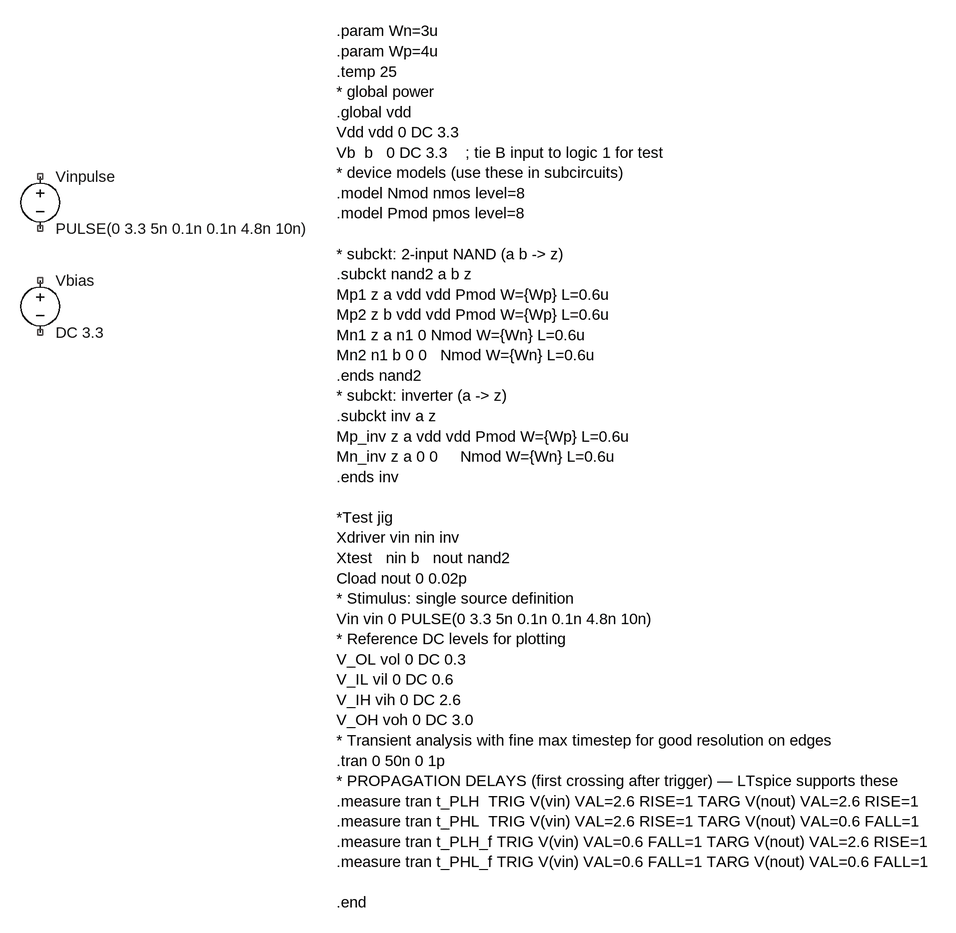
[diagram p0: schematic E.asc]
E.asc, the LTspice schematic file:
Version 4.1
SHEET 1 1580 1692
SYMBOL voltage 96 -144 R0
WINDOW 123 0 0 Left 0
WINDOW 39 0 0 Left 0
SYMATTR InstName Vinpulse
SYMATTR Value PULSE(0 3.3 5n 0.1n 0.1n 4.8n 10n)
SYMBOL voltage 96 16 R0
WINDOW 123 0 0 Left 0
WINDOW 39 0 0 Left 0
SYMATTR InstName Vbias
SYMATTR Value DC 3.3
TEXT 552 -352 Left 2 !.param Wn=3u\n.param Wp=4u\n.temp 25\n* global power\n.global vdd\nVdd vdd 0 DC 3.3\nVb  b   0 DC 3.3    ; tie B input to logic 1 for test\n* device models (use these in subcircuits)\n.model Nmod nmos level=8\n.model Pmod pmos level=8\n \n* subckt: 2-input NAND (a b -> z)\n.subckt nand2 a b z\nMp1 z a vdd vdd Pmod W={Wp} L=0.6u\nMp2 z b vdd vdd Pmod W={Wp} L=0.6u\nMn1 z a n1 0 Nmod W={Wn} L=0.6u\nMn2 n1 b 0 0   Nmod W={Wn} L=0.6u\n.ends nand2\n* subckt: inverter (a -> z)\n.subckt inv a z\nMp_inv z a vdd vdd Pmod W={Wp} L=0.6u\nMn_inv z a 0 0     Nmod W={Wn} L=0.6u\n.ends inv\n \n*Test jig \nXdriver vin nin inv\nXtest   nin b   nout nand2\nCload nout 0 0.02p\n* Stimulus: single source definition \nVin vin 0 PULSE(0 3.3 5n 0.1n 0.1n 4.8n 10n)\n* Reference DC levels for plotting \nV_OL vol 0 DC 0.3\nV_IL vil 0 DC 0.6\nV_IH vih 0 DC 2.6\nV_OH voh 0 DC 3.0\n* Transient analysis with fine max timestep for good resolution on edges\n.tran 0 50n 0 1p\n* PROPAGATION DELAYS (first crossing after trigger) — LTspice supports these\n.measure tran t_PLH  TRIG V(vin) VAL=2.6 RISE=1 TARG V(nout) VAL=2.6 RISE=1\n.measure tran t_PHL  TRIG V(vin) VAL=2.6 RISE=1 TARG V(nout) VAL=0.6 FALL=1\n.measure tran t_PLH_f TRIG V(vin) VAL=0.6 FALL=1 TARG V(nout) VAL=2.6 RISE=1\n.measure tran t_PHL_f TRIG V(vin) VAL=0.6 FALL=1 TARG V(nout) VAL=0.6 FALL=1\n \n.end

The netlist it stands for:
* E.asc
Vinpulse NC_01 NC_02 PULSE(0 3.3 5n 0.1n 0.1n 4.8n 10n)
Vbias NC_03 NC_04 DC 3.3
.param Wn=3u
.param Wp=4u
.temp 25
* global power
.global vdd
Vdd vdd 0 DC 3.3
Vb  b   0 DC 3.3    ; tie B input to logic 1 for test
* device models (use these in subcircuits)
.model Nmod nmos level=8
.model Pmod pmos level=8
* subckt: 2-input NAND (a b -> z)
.subckt nand2 a b z
Mp1 z a vdd vdd Pmod W={Wp} L=0.6u
Mp2 z b vdd vdd Pmod W={Wp} L=0.6u
Mn1 z a n1 0 Nmod W={Wn} L=0.6u
Mn2 n1 b 0 0   Nmod W={Wn} L=0.6u
.ends nand2
* subckt: inverter (a -> z)
.subckt inv a z
Mp_inv z a vdd vdd Pmod W={Wp} L=0.6u
Mn_inv z a 0 0     Nmod W={Wn} L=0.6u
.ends inv
*Test jig
Xdriver vin nin inv
Xtest   nin b   nout nand2
Cload nout 0 0.02p
* Stimulus: single source definition
Vin vin 0 PULSE(0 3.3 5n 0.1n 0.1n 4.8n 10n)
* Reference DC levels for plotting
V_OL vol 0 DC 0.3
V_IL vil 0 DC 0.6
V_IH vih 0 DC 2.6
V_OH voh 0 DC 3.0
* Transient analysis with fine max timestep for good resolution on edges
.tran 0 50n 0 1p
* PROPAGATION DELAYS (first crossing after trigger) — LTspice supports these
.measure tran t_PLH  TRIG V(vin) VAL=2.6 RISE=1 TARG V(nout) VAL=2.6 RISE=1
.measure tran t_PHL  TRIG V(vin) VAL=2.6 RISE=1 TARG V(nout) VAL=0.6 FALL=1
.measure tran t_PLH_f TRIG V(vin) VAL=0.6 FALL=1 TARG V(nout) VAL=2.6 RISE=1
.measure tran t_PHL_f TRIG V(vin) VAL=0.6 FALL=1 TARG V(nout) VAL=0.6 FALL=1
.end
.backanno
.end